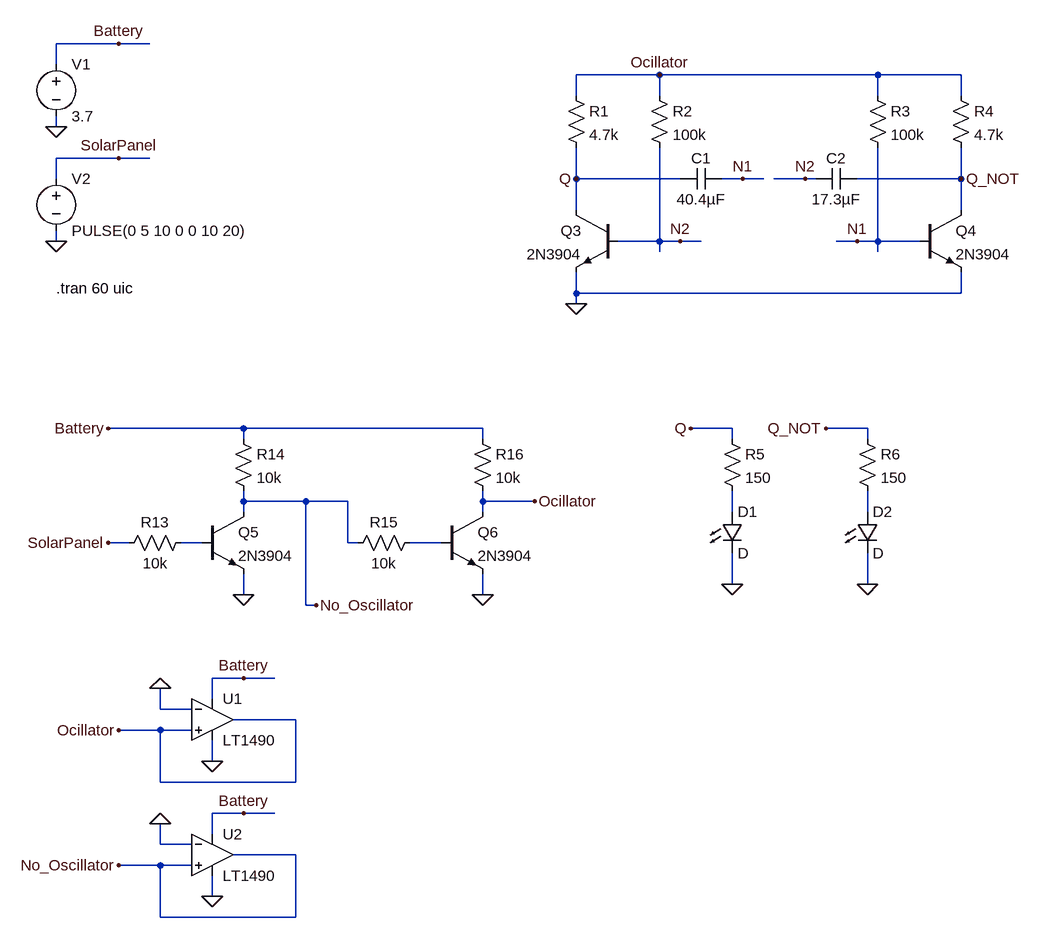
[diagram p0: schematic EE330_FinalProject.asc]
EE330_FinalProject.asc, the LTspice schematic file:
Version 4
SHEET 1 1876 1888
WIRE 256 32 160 32
WIRE 304 32 256 32
WIRE 160 64 160 32
WIRE 1088 80 960 80
WIRE 1424 80 1088 80
WIRE 1552 80 1424 80
WIRE 960 112 960 80
WIRE 1088 112 1088 80
WIRE 1424 112 1424 80
WIRE 1552 112 1552 80
WIRE 160 160 160 144
WIRE 256 208 160 208
WIRE 304 208 256 208
WIRE 160 240 160 208
WIRE 960 240 960 192
WIRE 1120 240 960 240
WIRE 1216 240 1184 240
WIRE 1248 240 1216 240
WIRE 1312 240 1264 240
WIRE 1328 240 1312 240
WIRE 1552 240 1552 192
WIRE 1552 240 1392 240
WIRE 960 288 960 240
WIRE 1552 288 1552 240
WIRE 160 336 160 320
WIRE 1088 336 1088 192
WIRE 1088 336 1024 336
WIRE 1120 336 1088 336
WIRE 1152 336 1120 336
WIRE 1392 336 1360 336
WIRE 1424 336 1424 192
WIRE 1424 336 1392 336
WIRE 1488 336 1424 336
WIRE 1088 352 1088 336
WIRE 1424 352 1424 336
WIRE 960 416 960 384
WIRE 1552 416 1552 384
WIRE 1552 416 960 416
WIRE 960 432 960 416
WIRE 448 624 240 624
WIRE 816 624 448 624
WIRE 1200 624 1136 624
WIRE 1408 624 1344 624
WIRE 448 640 448 624
WIRE 816 640 816 624
WIRE 1200 640 1200 624
WIRE 1408 640 1408 624
WIRE 448 736 448 720
WIRE 544 736 448 736
WIRE 608 736 544 736
WIRE 816 736 816 720
WIRE 896 736 816 736
WIRE 448 752 448 736
WIRE 816 752 816 736
WIRE 1200 752 1200 720
WIRE 1408 752 1408 720
WIRE 272 800 240 800
WIRE 384 800 352 800
WIRE 608 800 608 736
WIRE 624 800 608 800
WIRE 752 800 704 800
WIRE 1200 864 1200 816
WIRE 1408 864 1408 816
WIRE 448 880 448 848
WIRE 816 880 816 848
WIRE 544 896 544 736
WIRE 560 896 544 896
WIRE 448 1008 400 1008
WIRE 496 1008 448 1008
WIRE 400 1040 400 1008
WIRE 320 1056 320 1024
WIRE 368 1056 320 1056
WIRE 528 1072 432 1072
WIRE 320 1088 256 1088
WIRE 368 1088 320 1088
WIRE 400 1136 400 1104
WIRE 320 1168 320 1088
WIRE 528 1168 528 1072
WIRE 528 1168 320 1168
WIRE 448 1216 400 1216
WIRE 496 1216 448 1216
WIRE 400 1248 400 1216
WIRE 320 1264 320 1232
WIRE 368 1264 320 1264
WIRE 528 1280 432 1280
WIRE 320 1296 256 1296
WIRE 368 1296 320 1296
WIRE 400 1344 400 1312
WIRE 320 1376 320 1296
WIRE 528 1376 528 1280
WIRE 528 1376 320 1376
FLAG 160 336 0
FLAG 160 160 0
FLAG 256 32 Battery
FLAG 256 208 SolarPanel
FLAG 240 800 SolarPanel
FLAG 1216 240 N1
FLAG 1392 336 N1
FLAG 1312 240 N2
FLAG 1120 336 N2
FLAG 960 432 0
FLAG 448 880 0
FLAG 240 624 Battery
FLAG 816 880 0
FLAG 896 736 Ocillator
FLAG 400 1136 0
FLAG 448 1008 Battery
FLAG 256 1088 Ocillator
FLAG 560 896 No_Oscillator
FLAG 320 1024 0
FLAG 400 1344 0
FLAG 448 1216 Battery
FLAG 320 1232 0
FLAG 256 1296 No_Oscillator
FLAG 1088 80 Ocillator
FLAG 960 240 Q
FLAG 1552 240 Q_NOT
FLAG 1200 864 0
FLAG 1136 624 Q
FLAG 1408 864 0
FLAG 1344 624 Q_NOT
SYMBOL Voltage 160 48 R0
SYMATTR InstName V1
SYMATTR Value 3.7
SYMBOL Voltage 160 224 R0
SYMATTR InstName V2
SYMATTR Value PULSE(0 5 10 0 0 10 20)
SYMBOL npn 1024 288 M0
SYMATTR InstName Q3
SYMATTR Value 2N3904
SYMBOL npn 1488 288 R0
SYMATTR InstName Q4
SYMATTR Value 2N3904
SYMBOL Cap 1184 224 R90
WINDOW 0 0 32 VBottom 2
WINDOW 3 32 32 VTop 2
SYMATTR InstName C1
SYMATTR Value 40.4µF
SYMBOL Cap 1392 224 R90
WINDOW 0 0 32 VBottom 2
WINDOW 3 32 32 VTop 2
SYMATTR InstName C2
SYMATTR Value 17.3µF
SYMBOL Res 1072 96 R0
SYMATTR InstName R2
SYMATTR Value 100k
SYMBOL Res 944 96 R0
SYMATTR InstName R1
SYMATTR Value 4.7k
SYMBOL Res 1408 96 R0
SYMATTR InstName R3
SYMATTR Value 100k
SYMBOL Res 1536 96 R0
SYMATTR InstName R4
SYMATTR Value 4.7k
SYMBOL Res 368 784 R90
WINDOW 0 0 56 VBottom 2
WINDOW 3 32 56 VTop 2
SYMATTR InstName R13
SYMATTR Value 10k
SYMBOL npn 384 752 R0
SYMATTR InstName Q5
SYMATTR Value 2N3904
SYMBOL Res 432 624 R0
SYMATTR InstName R14
SYMATTR Value 10k
SYMBOL npn 752 752 R0
SYMATTR InstName Q6
SYMATTR Value 2N3904
SYMBOL Res 720 784 R90
WINDOW 0 0 56 VBottom 2
WINDOW 3 32 56 VTop 2
SYMATTR InstName R15
SYMATTR Value 10k
SYMBOL Res 800 624 R0
SYMATTR InstName R16
SYMATTR Value 10k
SYMBOL LT1490 400 1008 R0
SYMATTR InstName U1
SYMBOL LT1490 400 1216 R0
SYMATTR InstName U2
SYMBOL LED 1184 752 R0
SYMATTR InstName D1
SYMBOL Res 1184 624 R0
SYMATTR InstName R5
SYMATTR Value 150
SYMBOL LED 1392 752 R0
SYMATTR InstName D2
SYMBOL Res 1392 624 R0
SYMATTR InstName R6
SYMATTR Value 150
TEXT 160 408 Left 2 !.tran 60 uic

The netlist it stands for:
* EE330_FinalProject.asc
V1 Battery 0 3.7
V2 SolarPanel 0 PULSE(0 5 10 0 0 10 20)
Q3 Q N2 0 0 2N3904
Q4 Q_NOT N1 0 0 2N3904
C1 N1 Q 40.4µF
C2 Q_NOT N2 17.3µF
R2 Ocillator N2 100k
R1 Ocillator Q 4.7k
R3 Ocillator N1 100k
R4 Ocillator Q_NOT 4.7k
R13 N003 SolarPanel 10k
Q5 No_Oscillator N003 0 0 2N3904
R14 Battery No_Oscillator 10k
Q6 Ocillator N004 0 0 2N3904
R15 N004 No_Oscillator 10k
R16 Battery Ocillator 10k
* U1: LT1490 (symbol LT1490 not available, pins judged from their places): In+=Ocillator In-=0 V+=Battery V-=0 OUT=Ocillator
* U2: LT1490 (symbol LT1490 not available, pins judged from their places): In+=No_Oscillator In-=0 V+=Battery V-=0 OUT=No_Oscillator
D1 N001 0 D
R5 Q N001 150
D2 N002 0 D
R6 Q_NOT N002 150
.model D D
.lib standard.dio
.model NPN NPN
.model PNP PNP
.lib standard.bjt
.tran 60 uic
.backanno
.end